# EAGLE design StrikeDetector (EAGLE 9.6.2)
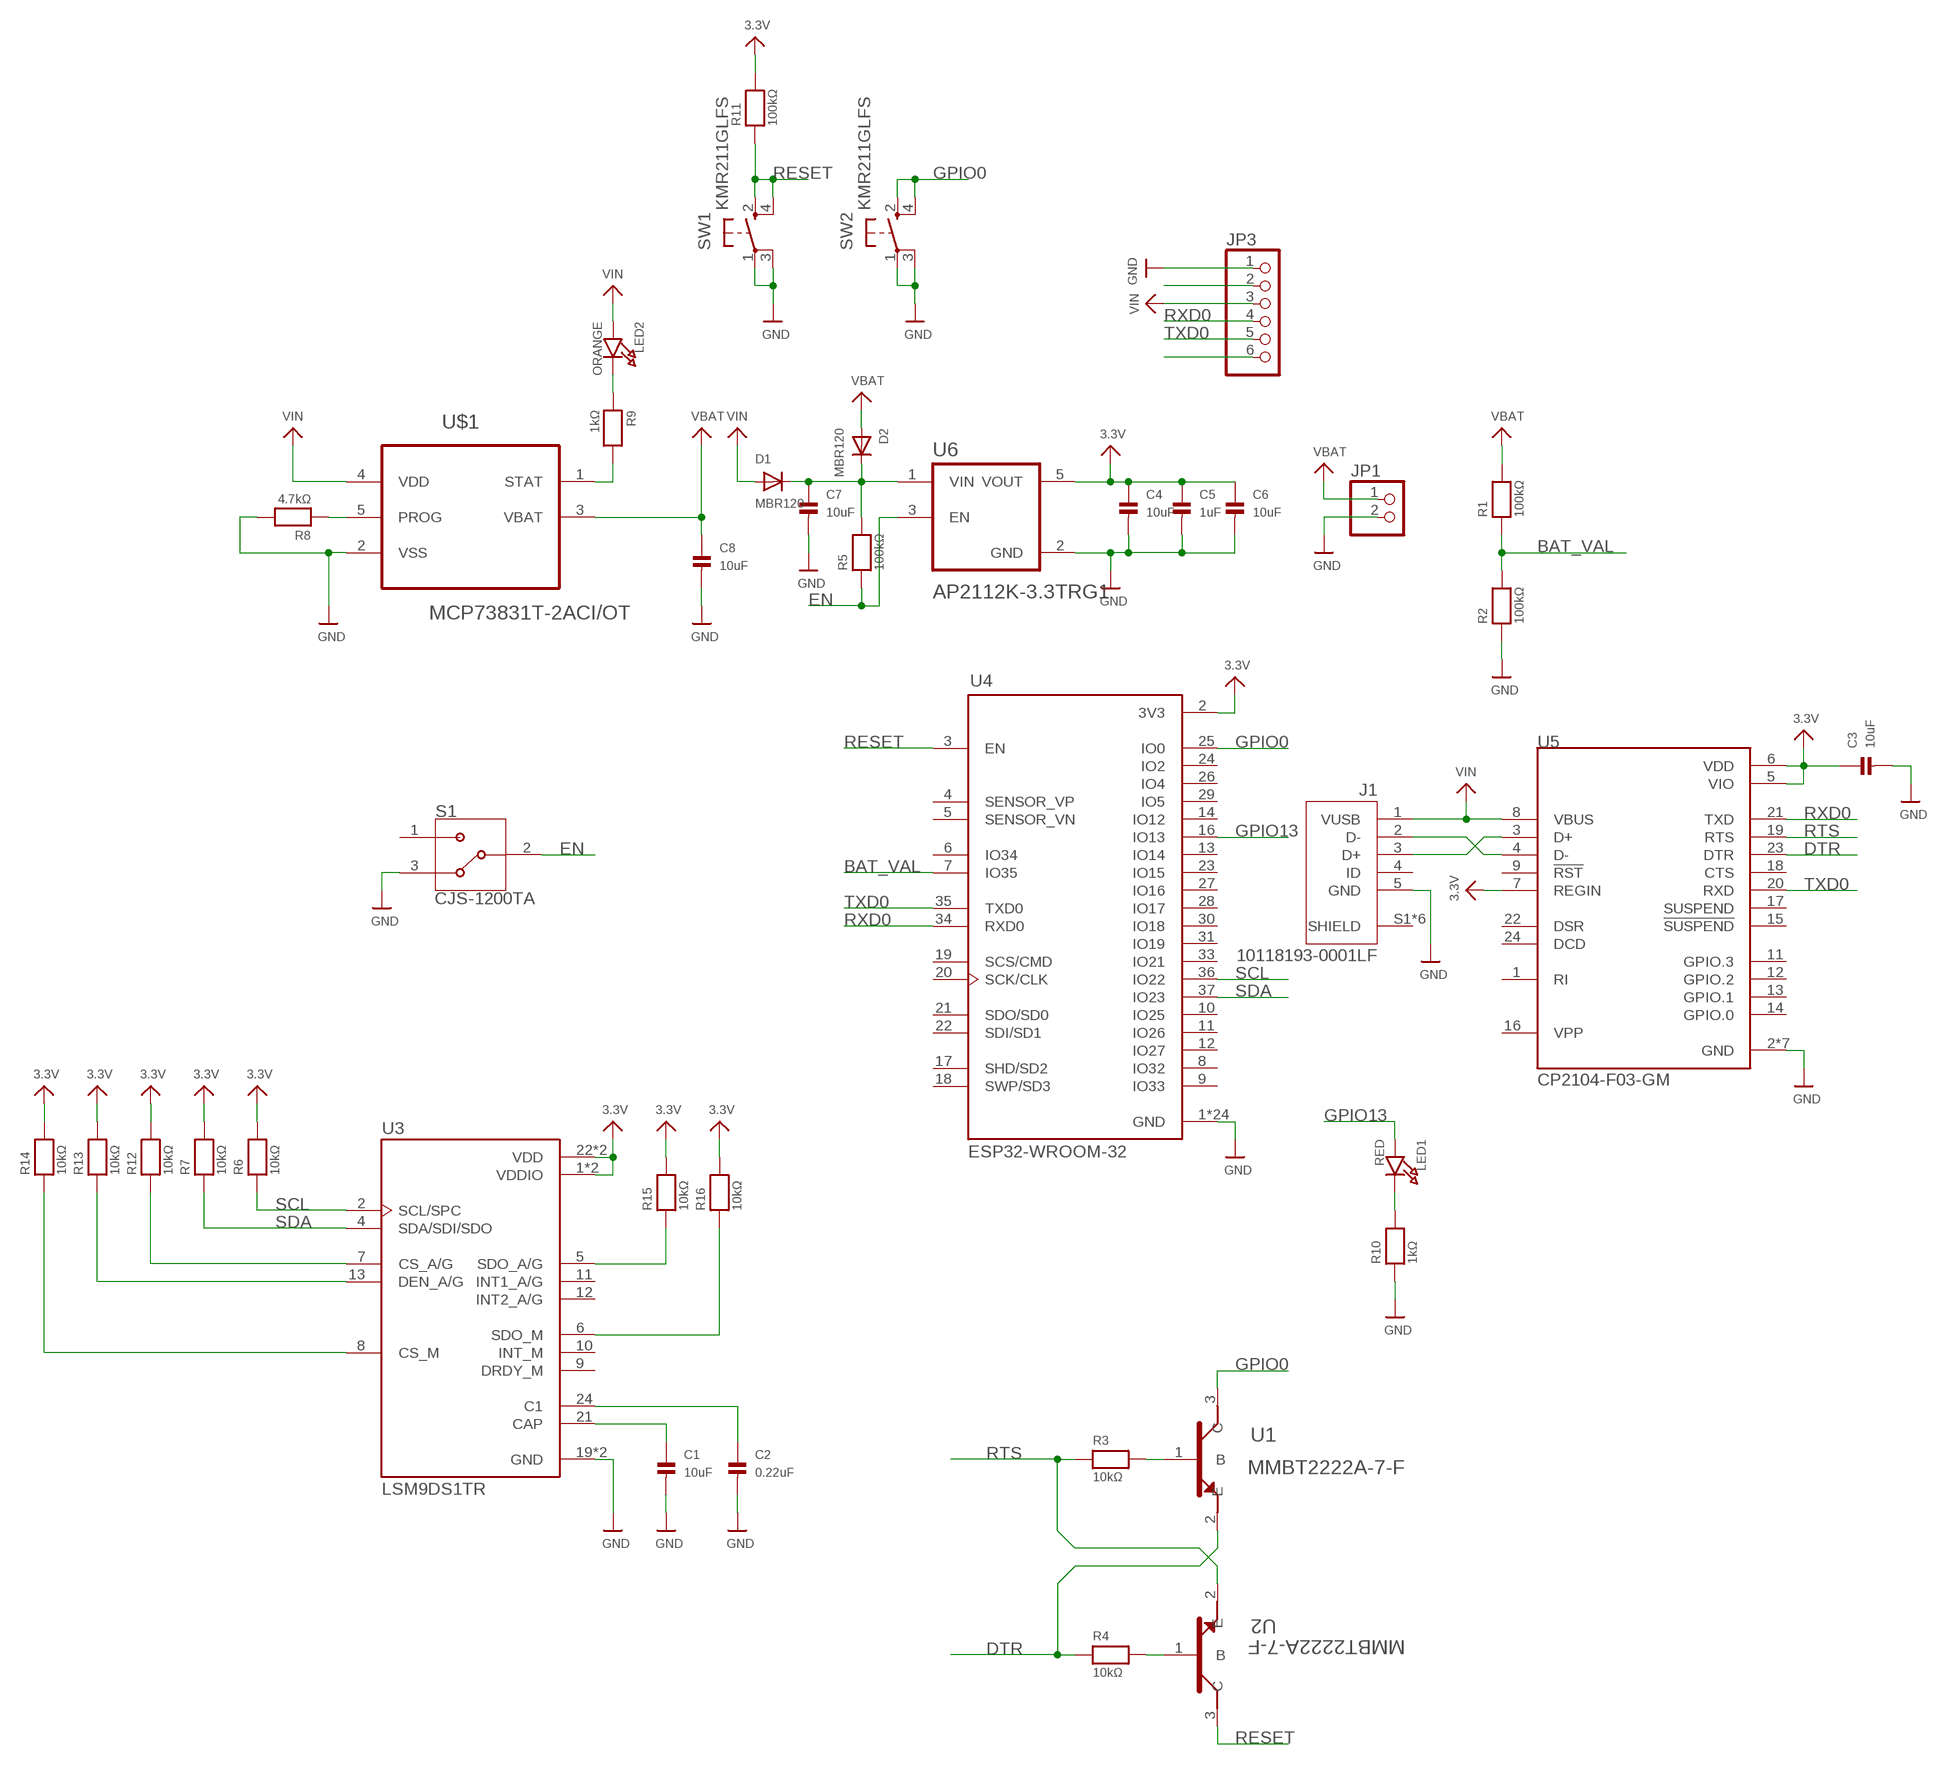
[diagram p0: schematic, sheet 1]

## Parts
C1  10uF  CAP_CERAMIC0603  [0603]
C2  0.22uF  CAP_CERAMIC0603  [0603]
C3  10uF  CAP_CERAMIC0603  [0603]
C4  10uF  CAP_CERAMIC0603  [0603]
C5  1uF  CAP_CERAMIC0603  [0603]
C6  10uF  CAP_CERAMIC0603  [0603]
C7  10uF  CAP_CERAMIC0603  [0603]
C8  10uF  CAP_CERAMIC0603  [0603]
D1  MBR120  DIODESOD-123  [SOD-123]
D2  MBR120  DIODESOD-123  [SOD-123]
J1  10118193-0001LF  [FCI_10118193-0001LF]
JP1  HEADER-1X2ROUND  [1X02_ROUND]
JP3  HEADER-1X6ROUND  [1X06_ROUND]
LED1  RED  LED0603  [CHIPLED_0603]
LED2  ORANGE  LED0603  [CHIPLED_0603]
R1  100kΩ  RESISTOR0603  [0603]
R2  100kΩ  RESISTOR0603  [0603]
R3  10kΩ  RESISTOR0603  [0603]
R4  10kΩ  RESISTOR0603  [0603]
R5  100kΩ  RESISTOR0603  [0603]
R6  10kΩ  RESISTOR0603  [0603]
R7  10kΩ  RESISTOR0603  [0603]
R8  4.7kΩ  RESISTOR0603  [0603]
R9  1kΩ  RESISTOR0603  [0603]
R10  1kΩ  RESISTOR0603  [0603]
R11  100kΩ  RESISTOR0603  [0603]
R12  10kΩ  RESISTOR0603  [0603]
R13  10kΩ  RESISTOR0603  [0603]
R14  10kΩ  RESISTOR0603  [0603]
R15  10kΩ  RESISTOR0603  [0603]
R16  10kΩ  RESISTOR0603  [0603]
S1  CJS-1200TA  [SW_CJS-1200TA]
SW1  KMR211GLFS  SPST_TACT-KMR2  [KMR2]
SW2  KMR211GLFS  SPST_TACT-KMR2  [KMR2]
U1  MMBT2222A-7-F  [SOT103P240X110-3N]
U2  MMBT2222A-7-F  [SOT103P240X110-3N]
U3  LSM9DS1TR  [PQFN43P300X350X102-24N]
U4  ESP32-WROOM-32  [MODULE_ESP32-WROOM-32]
U5  CP2104-F03-GM  [QFN50P400X400X80-25N]
U6  AP2112K-3.3TRG1  [SOT95P285X140-5N]
U$1  MCP73831T-2ACI/OT  [SOT95P280X145-5N]

## Nets
3.3V: C3.1 C4.1 C5.1 C6.1 R6.2 R7.2 R11.2 R12.2 R13.2 R14.2 R15.2 R16.2 U3.1(VDDIO) U3.3(VDDIO) U3.22(VDD) U3.23(VDD) U4.2(3V3) U5.5(VIO) U5.6(VDD) U5.7(REGIN) U6.5(VOUT)
BAT_VAL: R1.1 R2.2 U4.7(IO35)
DTR: R4.1 U1.2(E) U5.23(DTR)
EN: R5.1 S1.2 U6.3(EN)
GND: C1.2 C2.2 C3.2 C4.2 C5.2 C6.2 C7.2 C8.2 J1.5(GND) JP1.2 JP3.1 R2.1 R8.2 R10.1 S1.3 SW1.1(P) SW1.3(P1) SW2.1(P) SW2.3(P1) U3.19(GND) U3.20(GND) U4.1(GND) U4.15(GND) U4.38(GND) U4.39_1(GND) U4.39_2(GND) U4.39_3(GND) U4.39_4(GND) U4.39_5(GND) U4.39_6(GND) U4.39_7(GND) U4.39_8(GND) U4.39_9(GND) U4.39_10(GND) U4.39_11(GND) U4.39_12(GND) U4.39_13(GND) U4.39_14(GND) U4.39_15(GND) U4.39_16(GND) U4.39_17(GND) U4.39_18(GND) U4.39_19(GND) U4.39_20(GND) U4.39_21(GND) U5.2(GND) U5.25(GND) U5.THERM_1(GND) U5.THERM_2(GND) U5.THERM_3(GND) U5.THERM_4(GND) U5.THERM_5(GND) U6.2(GND) U$1.2(VSS)
GPIO0: SW2.2(S) SW2.4(S1) U1.3(C) U4.25(IO0)
GPIO13: LED1.A U4.16(IO13)
N$1: C1.1 U3.21(CAP)
N$2: J1.3(D+) U5.3(D+)
N$3: J1.2(D-) U5.4(D-)
N$4: C2.1 U3.24(C1)
N$5: R3.2 U1.1(B)
N$6: R4.2 U2.1(B)
N$7: C7.1 D1.C D2.C R5.2 U6.1(VIN)
N$8: R8.1 U$1.5(PROG)
N$9: R9.2 U$1.1(STAT)
N$10: LED2.C R9.1
N$11: LED1.C R10.2
N$12: R12.1 U3.7(CS_A/G)
N$13: JP3.2
N$14: R13.1 U3.13(DEN_A/G)
N$15: R14.1 U3.8(CS_M)
N$16: R15.1 U3.5(SDO_A/G)
N$17: JP3.6
N$18: R16.1 U3.6(SDO_M)
RESET: R11.1 SW1.2(S) SW1.4(S1) U2.3(C) U4.3(EN)
RTS: R3.1 U2.2(E) U5.19(RTS)
RXD0: JP3.4 U4.34(RXD0) U5.21(TXD)
SCL: R6.1 U3.2(SCL/SPC) U4.36(IO22)
SDA: R7.1 U3.4(SDA/SDI/SDO) U4.37(IO23)
TXD0: JP3.5 U4.35(TXD0) U5.20(RXD)
VBAT: C8.1 D2.A JP1.1 R1.2 U$1.3(VBAT)
VIN: D1.A J1.1(VUSB) JP3.3 LED2.A U5.8(VBUS) U$1.4(VDD)
Unconnected: J1.4(ID) J1.S1(SHIELD) J1.S2(SHIELD) J1.S3(SHIELD) J1.S4(SHIELD) J1.S5(SHIELD) J1.S6(SHIELD) S1.1 U3.9(DRDY_M) U3.10(INT_M) U3.11(INT1_A/G) U3.12(INT2_A/G) U4.4(SENSOR_VP) U4.5(SENSOR_VN) U4.6(IO34) U4.8(IO32) U4.9(IO33) U4.10(IO25) U4.11(IO26) U4.12(IO27) U4.13(IO14) U4.14(IO12) U4.17(SHD/SD2) U4.18(SWP/SD3) U4.19(SCS/CMD) U4.20(SCK/CLK) U4.21(SDO/SD0) U4.22(SDI/SD1) U4.23(IO15) U4.24(IO2) U4.26(IO4) U4.27(IO16) U4.28(IO17) U4.29(IO5) U4.30(IO18) U4.31(IO19) U4.33(IO21) U5.1(RI) U5.9(!RST) U5.11(GPIO.3) U5.12(GPIO.2) U5.13(GPIO.1) U5.14(GPIO.0) U5.15(!SUSPEND) U5.16(VPP) U5.17(SUSPEND) U5.18(CTS) U5.22(DSR) U5.24(DCD)

## Library data of the parts
C1-C8 = microbuilder:CAP_CERAMIC: Ceramic Capacitors 0402 - 0402 Surface Mount Capacitors 16pF 50V 5% [Digikey: 445-4899-2-ND] 18pF 50V 5% [Digikey: 490-1281-2-ND] 22pF 50V 5% [Digikey: 490-1283-2-ND] 68pF 50V 5% [Digikey: 490-1289-2-ND] 0.1uF 10V 10% [Digikey: 490-1318-2-ND] 1.0uF 6.3V 10% [Digikey: 490-1320-2-ND] 0603 - 0603 Surface Mount Capacitors 16 pF 50V 5% [Digikey: 445-5051-2-ND] 22 pF 50V [Digikey: PCC220ACVTR-ND] 33 pF 50V 5% [Digikey: 490-1415-1-ND] 56pF 50V 5% [Digikey: 490-1421-1-ND] 220pF 50V 5% [Digikey: 445-1285-1-ND] 680 pF 50V 2200 pF 50V 5% C0G [Digikey: 445-1297-1-ND] 5600 pF 100V 5% X7R [Digikey: 478-3711-1-ND] 0.1 µF 25V 10% [Digikey: PCC2277TR-ND] 0.22 µF 16V 10% X7R [Digikey: 445-1318-1-ND] 1.0 µF 25V 10% [Digikey: 445-5146-2-ND] 0603 - RF Specific 3pF 250V +/-0.1pF RF [Digikey: 712-1347-1-ND] 18 pF 250V 5% [Digikey: 478-3505-1-ND or 712-1322-1-ND] 56 pF 250V 5% C0G RF [Digikey: 490-4867-1-ND] 68 pF 250V RF [Digikey: 490-4868-1-ND] 0805 - 0805 Surface Mount Capacitors 220 pF 250V 2% RF Ceramic Capacitor [Digikey: 712-1398-1-ND] 1000 pF 50V 2% NP0 Ceramic Capacitor [Digikey: 478-3760-1-ND] 0.1 µF 25V 10% Ceramic Capacitor [Digikey: PCC1828TR-ND] 1.0 µF 16V 10% Ceramic Capacitor[Digikey: 490-1691-2-ND] 10.0 µF 10V 10% Ceramic Capacitor[Digikey: 709-1228-1-ND] 10.0 uF 16V 10% Ceramic Capacitor [Digikey: 478-5165-2-ND] 47 uF 6.3V 20% Ceramic Capacitor [Digikey: 587-1779-1-ND or 399-5506-1-ND] 1206 - 1206 Surface Mount Capacitors 47uF 10V 20% Ceramic Capacitor [Digikey: 490-5528-1-ND or 399-5508-1-ND or 445-6010-1-ND] 100uF 6.3V -20%, +80% Y5V Ceramic Capacitor (Digikey: 490-4512-1-ND, Mouser: 81-GRM31CF50J107ZE1L)
D1 D2 = microbuilder:DIODE: Diode SMA Model Volts Amps Type Vf Vr Digikey # Notes SSA34-E3 40V 3A Schottky 480mV @ 3A 200uA @ 40V SSA34-E3/61TGITR-ND CDBA120-G 20V 1A Schottky 500mV @ 1A 500uA @ 20V 641-1014-6-ND REEL MBRA210 10V 2A Schottky 350mV @ 2A 700uA @ 10V MBRA210LT3 SOD-123 Model Volts Amps Type Vf Vr Order # Notes BAT54T1G 30V 200mA Schottky 800mV @ 200mA 2uA @ 25V BAT54T1GOSTR-ND B0530W 30V 500mA Schottky 430mV @ 500mA 130uA @ 30V B0530W-FDICT-ND REEL MBR120 1A 20V Schottky 340mV @ 1A MBR120VLSFT1GOSCT-ND SOD-323 Model Volts Amps Type Vf Vr Order # Notes PMEG2005EJ 20V 500mA Schottky 355mV @ 500mA 568-4110-1-ND ZLLS410 10V 570mA Schottky 380mV @ 570mA ZLLS410CT-ND 1N4148WS 75V 150mA Silicon/Simple 1V 1N4148WSFSCT-ND REEL SOD-523 Model Volts Amps Type Vf Vr Order # Notes BAT54XV2 30V 200mA Schottky 0.8V @ 100mA BAT54XV2CT-ND TB751S 30V 30mA Schottky RB751S-40TE61CT-ND SOT23-R/W (R = Solder Paste/Reflow Ovens, W = Hand-Soldering) Model Volts Amps Type Vf Vr Order # Notes BAT54FILM 40V 300mA Schottky 497-7162-1-ND
J1 = 10118193-0001LF:10118193-0001LF: Micro USB B Type Receptacle; DESCRIPTION: USB - micro B USB 2.0 Receptacle Connector 5 Position Surface Mount, Right Angle; Through Hole; DIGI-KEY_PART_NUMBER: 609-4616-1-ND; DIGIKEY-PURCHASE-URL: https://snapeda.com/shop?store=DigiKey&id=4800618; MF: Amphenol ICC (FCI); MOUSER-PURCHASE-URL: https://snapeda.com/shop?store=Mouser&id=4800618; MP: 10118193-0001LF; PACKAGE: None
JP1 = microbuilder:HEADER-1X2: PIN HEADER
JP3 = microbuilder:HEADER-1X6: PIN HEADER
LED1 LED2 = microbuilder:LED: LED 0603 - 0603 Surface Mount Package 2mA: Green LED - Low Power (3.9mcd, 2ma, 1.7Vf) - Digikey: 475-2709-2-ND Orange LED - Low Power (9.8mcd, 2ma, 1.8Vf) - Digikey: 475-1194-2-ND Red LED - Low Power (5mcd, 2ma, 1.8Vf) - Digikey: 475-1195-2-ND Yellow LED - Low Power (7mcd, 2ma, 1.8Vf) - Digikey: 475-1196-2-ND 5mA: Blue LED - Low Power (17mcd, 5ma, 2.9Vf) - Digikey: LNJ937W8CRACT-ND 0805 - 0805 Surface Mount Package 2mA: Red LED (8.8mcd, 2mA, 1.8Vf, Clear) - Low Power [Digikey: 475-2510-1-ND] Green LED (5mcd, 2mA, 1.8Vf, Clear) - Low Power [Digikey: 475-2730-1-ND] Yellow LED (11.3mcd, 2mA, 1.8Vf, Clear) - Low Power [Digikey: 475-2555-1-ND] 20mA: Red LED (104mcd, 20mA, Diffused) - LS R976 [Digikey: 475-1278-6-ND] Red LED (12mcd, 20mA, 2.0Vf, Clear) - APT2012EC [Digikey: 754-1128-1-ND] Green LED (15mcd, 20mA, 2.2Vf, Clear) - APT2012GC [Digikey: 754-1131-1-ND] Orange LED (160mcd, 20mA, 2.1Vf, Clear) - APT2012SECK [Digikey: 754-1130-1-ND] 1206 - 1206 Surface Mount Package Green LED (26mcd, 20mA, Diffused) - LG N971 [Digikey: 475-1407-6-ND] Red LED (15mcd, 20mA, Diffused) - LH N974 [Digikey: 475-1416-6-ND]
R1-R16 = microbuilder:RESISTOR: Resistors 0402 - 0402 Surface Mount Package 22 Ohm 1% 1/16W [Digikey: 311-22.0LRTR-ND] 33 Ohm 5% 1/16W 1.0K 5% 1/16W 1.5K 5% 1/16W 2.0K 1% 1/16W 10.0K 1% 1/16W [Digikey: 311-10.0KLRTR-ND] 10.0K 5% 1/16W [Digikey: RMCF0402JT10K0TR-ND] 12.1K 1% 1/16W [Digikey: 311-22.0LRTR-ND] 100.0K 5% 1/16W 0603 - 0603 Surface Mount Package 0 Ohm 1/10 Watt 1% Resistor 15 Ohm 1/10 Watt 1% Resistor 33 Ohm 1/10 Watt 1% Resistor 49.9 Ohm 1/10 Watt 1% Resistor 100 Ohm 1/10 Watt 1% Resistor 150 Ohm 1/10 Watt 1% Resistor 240 Ohm 1/10 Watt 1% Resistor 390 Ohm 1/10 Watt 1% Resistor 560 Ohm 1/10 Watt 1% Resistor 680 Ohm 1/10 Watt 1% Resistor 750 Ohm 1/10 Watt 1% Resistor 1.0K Ohm 1/10 Watt 1% Resistor 1.5K Ohm 1/10 Watt 1% Resistor 2.0K Ohm 1/10 Watt 1% Resistor 2.2K Ohm 1/10 Watt 1% Resistor 3.3K Ohm 1/10 Watt 1% Resistor 4.7K Ohm 1/10 Watt 1% Resistor 10.0K Ohm 1/10 Watt 1% Resistor 12.0K Ohm 1/10 Watt 1% Resistor 12.1K Ohm 1/10 Watt 1% Resistor 20.0K Ohm 1/10 Watt 1% Resistor 33.0K Ohm 1/10 Watt 1% Resistor 100.0K Ohm 1/10 Watt 1% Resistor 0805 - 0805 Surface Mount Package 0 Ohm 1/8 Watt 1% Resistor 33 Ohm 1/8 Watt 1% Resistor 100 Ohm 1/8 Watt 1% Resistor 150 Ohm 1/8 Watt 1% Resistor 200 Ohm 1/8 Watt 1% Resistor 240 Ohm 1/8 Watt 1% Resistor 330 Ohm 1/8 Watt 1% Resistor 390 Ohm 1/8 Watt 1% Resistor 470 Ohm 1/8 Watt 1% Resistor 1.0K Ohm 1/8 Watt 1% Resistor 1.5K Ohm 1/8 Watt 1% Resistor 2.0K Ohm 1/8 Watt 1% Resistor 4.7K Ohm 1/8 Watt 1% Resistor 5.1K Ohm 1/8 Watt 1% Resistor 5.6K Ohm 1/8 Watt 1% Resistor 10.0K Ohm 1/8 Watt 1% Resistor 22.0K Ohm 1/8 Watt 1% Resistor 33.0K Ohm 1/8 Watt 1% Resistor 100K Ohm 1/8 Watt 1% Resistor 1206 - 1206 Surface Mount Package 2012 - 2010 Surface Mount Package 0.11 Ohm 1/2 Watt 1% Resistor - Digikey: RHM.11UCT-ND
S1 = CJS-1200TA:CJS-1200TA: Switch Slide N.O./N.C. SPDT Raised Slide 0.1A 24VDC J-Hook SMD Embossed T/R; DESCRIPTION: Slide Switch SPDT Surface Mount; DIGI-KEY_PART_NUMBER: 563-1021-1-ND; DIGIKEY-PURCHASE-URL: https://snapeda.com/shop?store=DigiKey&id=2766327; MF: Nidec Copal; MOUSER-PURCHASE-URL: https://snapeda.com/shop?store=Mouser&id=2766327; MP: CJS-1200TA; PACKAGE: None
SW1 SW2 = adafruit:SPST_TACT: SMT 6mm switch, EVQQ2 series http://www.ladyada.net/library/eagle
U1 U2 = MMBT2222A-7-F:MMBT2222A-7-F: NPN SMALL SIGNAL SURFACE MOUNT TRANSISTOR; DESCRIPTION: Bipolar (BJT) Transistor NPN 40V 600mA 300MHz 310mW Surface Mount SOT-23-3; DIGI-KEY_PART_NUMBER: MMBT2222A-FDICT-ND; DIGIKEY-PURCHASE-URL: https://snapeda.com/shop?store=DigiKey&id=229424; MF: Diodes Inc.; MOUSER-PURCHASE-URL: https://snapeda.com/shop?store=Mouser&id=229424; MP: MMBT2222A-7-F; PACKAGE: SOT-23-3 Diodes Inc.
U3 = LSM9DS1TR:LSM9DS1TR: The LSM9DS1 is a system-in-package featuring a 3D digital linear acceleration sensor, a 3D digital angular rate sensor, and a 3D digital magnetic sensor.; DESCRIPTION: Accelerometer, Gyroscope, Magnetometer, Temperature, 9 Axis Sensor I²C, SPI Output; DIGI-KEY_PART_NUMBER: 497-14946-1-ND; DIGIKEY-PURCHASE-URL: https://snapeda.com/shop?store=DigiKey&id=106273; MF: STMicroelectronics; MOUSER-PURCHASE-URL: https://snapeda.com/shop?store=Mouser&id=106273; MP: LSM9DS1TR; PACKAGE: TFLGA-24 STMicroelectronics
U4 = ESP32-WROOM-32:ESP32-WROOM-32: Bluetooth, WiFi Transceiver Module 2.4GHz ~ 2.5GHz Surface Mount; DESCRIPTION: Bluetooth, WiFi Transceiver Module 2.4GHz ~ 2.5GHz Surface Mount; DIGI-KEY_PART_NUMBER: 1904-1010-1-ND; MF: Espressif Systems; MP: ESP32-WROOM-32; PACKAGE: Module Espressif Systems
U5 = CP2104-F03-GM:CP2104-F03-GM: USB-to-UART 1-CH 576byte FIFO 3.3V 24-Pin QFN EP T/R; DESCRIPTION: USB Bridge, USB to UART USB 2.0 UART Interface 24-QFN (4x4); DIGI-KEY_PART_NUMBER: 336-4146-2-ND; MF: Silicon Labs; MP: CP2104-F03-GM; PACKAGE: QFN-24 Silicon Labs
U6 = AP2112K-3.3TRG1:AP2112K-3.3TRG1: AP2112 Series 0.6 A 3.3 V Fixed Output SMT LDO Linear Regulator - SOT23-5; DESCRIPTION: Linear Voltage Regulator IC 1 Output 600mA SOT-25; DIGI-KEY_PART_NUMBER: AP2112K-3.3TRG1DICT-ND; DIGIKEY-PURCHASE-URL: https://snapeda.com/shop?store=DigiKey&id=454988; MF: Diodes Inc.; MOUSER-PURCHASE-URL: https://snapeda.com/shop?store=Mouser&id=454988; MP: AP2112K-3.3TRG1; PACKAGE: SOT-753 Diodes Inc.
U$1 = MCP73831T-2ACI_OT:MCP73831T-2ACI/OT: Charge Management Controller; DESCRIPTION: Charger IC Lithium Ion/Polymer SOT-23-5; DIGI-KEY_PART_NUMBER: MCP73831T-2ACI/OTCT-ND; DIGIKEY-PURCHASE-URL: https://snapeda.com/shop?store=DigiKey&id=53208; MF: Microchip; MOUSER-PURCHASE-URL: https://snapeda.com/shop?store=Mouser&id=53208; MP: MCP73831T-2ACI/OT; PACKAGE: SOT-23 Microchip

## Board
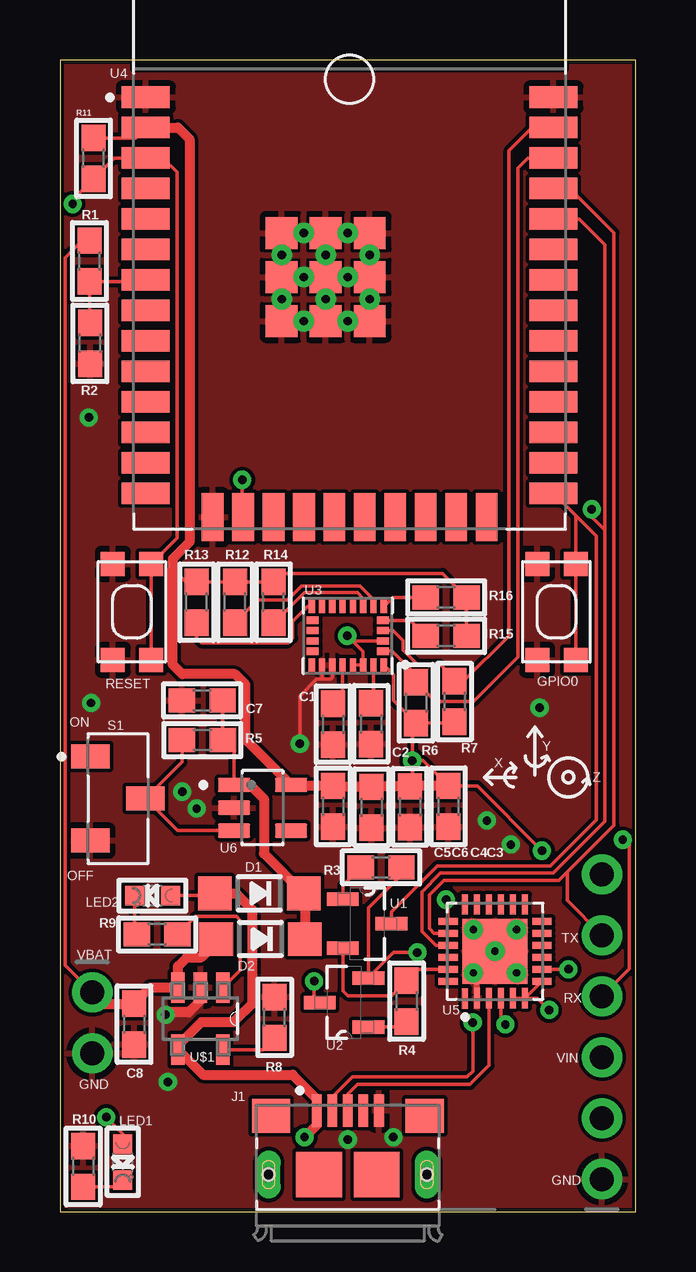
[diagram p1: board, top side]
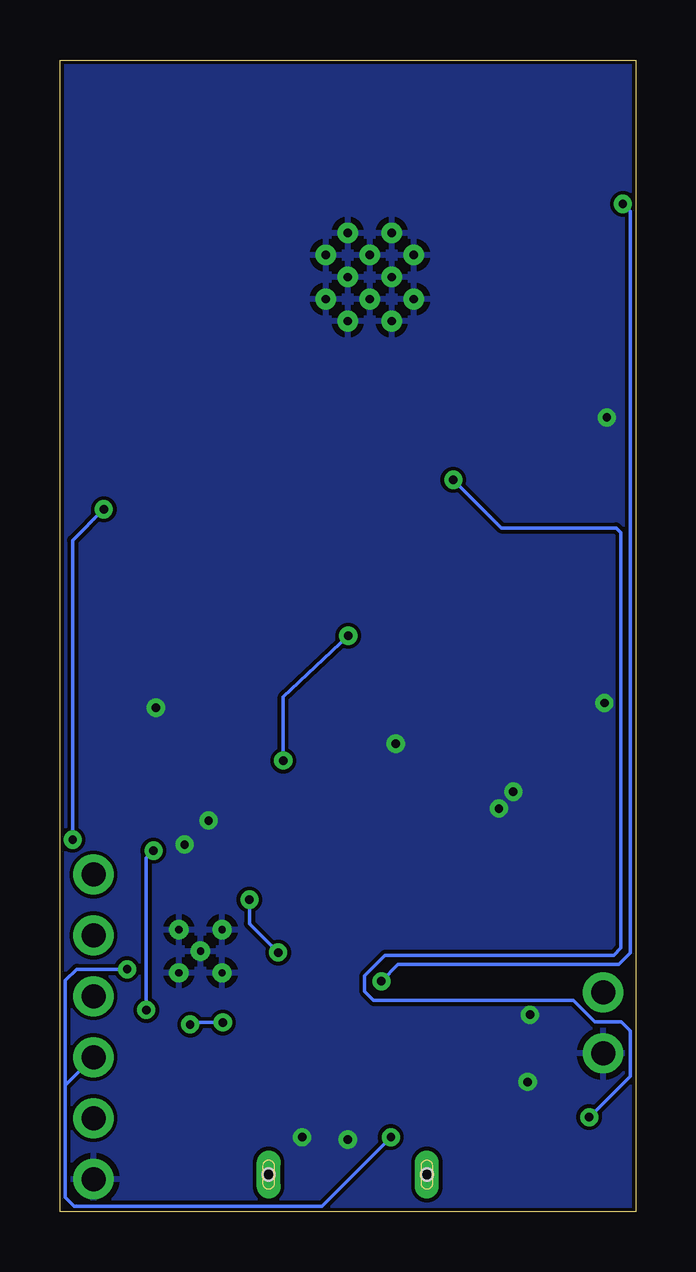
[diagram p2: board, bottom side, seen from below]

Size 24 x 48 mm. Coordinates in mm from the lower left corner, seen from the top.
Outline: 0,0 24,0 24,48 0,48 0,0
Copper layers (1*16): Top 0.035mm / dielectric 1.5mm / Bottom 0.035mm
Design rules "default *": minimum track width 6mil, minimum drill 0.35mm, track to track 5mil, track to pad 5mil, pad to pad 5mil, via to via 5mil, smd to smd 5mil, copper to edge 5mil, drill to drill 5mil, minimum pad ring 10mil, minimum via ring 8mil, stop-mask expansion 4mil, vias tented up to drill 0mil, thermal gap 10mil

### Footprints (pad centres in the part's own frame; a part is rotated, then mirrored left to right if it is on the bottom)
0603 = smd 1.1 x 1: 1 -0.85,0; 2 0.85,0
SOD-123 = smd 1.4 x 1.4: A 1.85,0; C -1.85,0
FCI_10118193-0001LF = smd 0.4 x 1.35: 1 -1.3,2.675; 2 -0.65,2.675; 3 0,2.675; 4 0.65,2.675; 5 1.3,2.675 | smd 1.6 x 1.4: S1 -3.2,2.45; S2 3.2,2.45 | smd 1.9 x 1.9: S3 1.2,0; S4 -1.2,0 | drill 0.5 pad 0.9 long: S5 -3.3,0; S6 3.3,0 | hole 0.5: -3.3,0; 3.3,0
1X02_ROUND = drill 1 pad 1.676: 1 -1.27,0; 2 1.27,0
1X06_ROUND = drill 1 pad 1.676: 1 -6.35,0; 2 -3.81,0; 3 -1.27,0; 4 1.27,0; 5 3.81,0; 6 6.35,0
CHIPLED_0603 = smd 0.8 x 0.8: A 0,-0.75; C 0,0.75
SW_CJS-1200TA = smd 1 x 1.6: 1 -1.75,-1.15; 2 0,1.15; 3 1.75,-1.15
KMR2 = smd 1 x 1: 1 2,0.8; 2 2,-0.8; 3 -2,0.8; 4 -2,-0.8
SOT103P240X110-3N = smd 1.321 x 0.559: 1 -1.016,1.016; 2 -1.016,-1.016; 3 1.016,0
PQFN43P300X350X102-24N = smd 0.28 x 0.53: 1 -1.505,1.22; 6 -1.505,-1.22; 7 -1.075,-1.22; 8 -0.645,-1.22; 9 -0.215,-1.22; 10 0.215,-1.22; 11 0.645,-1.22; 12 1.075,-1.22; 13 1.505,-1.22; 18 1.505,1.22; 19 1.075,1.22; 20 0.645,1.22; 21 0.215,1.22; 22 -0.215,1.22; 23 -0.645,1.22; 24 -1.075,1.22 | smd 0.53 x 0.28: 2 -1.47,0.645; 3 -1.47,0.215; 4 -1.47,-0.215; 5 -1.47,-0.645; 14 1.47,-0.645; 15 1.47,-0.215; 16 1.47,0.215; 17 1.47,0.645
MODULE_ESP32-WROOM-32 = smd 2 x 0.9: 1 -8.5,5.26; 2 -8.5,3.99; 3 -8.5,2.72; 4 -8.5,1.45; 5 -8.5,0.18; 6 -8.5,-1.09; 7 -8.5,-2.36; 8 -8.5,-3.63; 9 -8.5,-4.9; 10 -8.5,-6.17; 11 -8.5,-7.44; 12 -8.5,-8.71; 13 -8.5,-9.98; 14 -8.5,-11.25; 25 8.5,-11.25; 26 8.5,-9.98; 27 8.5,-8.71; 28 8.5,-7.44; 29 8.5,-6.17; 30 8.5,-4.9; 31 8.5,-3.63; 32 8.5,-2.36; 33 8.5,-1.09; 34 8.5,0.18; 35 8.5,1.45; 36 8.5,2.72; 37 8.5,3.99; 38 8.5,5.26 | smd 0.9 x 2: 15 -5.715,-12.25; 16 -4.445,-12.25; 17 -3.175,-12.25; 18 -1.905,-12.25; 19 -0.635,-12.25; 20 0.635,-12.25; 21 1.905,-12.25; 22 3.175,-12.25; 23 4.445,-12.25; 24 5.715,-12.25 | smd 1.33 x 1.33: 39_1 -2.835,-0.405; 39_2 -1,-0.405; 39_3 0.835,-0.405; 39_4 -2.835,-2.24; 39_5 -1,-2.24; 39_6 0.835,-2.24; 39_7 -2.835,-4.075; 39_8 -1,-4.075; 39_9 0.835,-4.075 | drill 0.35: 39_10 -1.917,-0.405; 39_11 -0.083,-0.405; 39_12 -2.835,-1.323; 39_13 -1,-1.323; 39_14 0.835,-1.323; 39_15 -1.917,-2.24; 39_16 -0.083,-2.24; 39_17 -2.835,-3.158; 39_18 -1,-3.158; 39_19 0.835,-3.158; 39_20 -1.917,-4.075; 39_21 -0.083,-4.075
QFN50P400X400X80-25N = smd 0.84 x 0.26: 1 -1.97,1.25 | smd 0.82 x 0.26: 2 -1.955,0.75; 3 -1.955,0.25; 4 -1.955,-0.25; 5 -1.955,-0.75; 6 -1.955,-1.25; 13 1.955,-1.25; 14 1.955,-0.75; 15 1.955,-0.25; 16 1.955,0.25; 17 1.955,0.75; 18 1.955,1.25 | smd 0.26 x 0.82: 7 -1.25,-1.955; 8 -0.75,-1.955; 9 -0.25,-1.955; 10 0.25,-1.955; 11 0.75,-1.955; 12 1.25,-1.955; 19 1.25,1.955; 20 0.75,1.955; 21 0.25,1.955; 22 -0.25,1.955; 23 -0.75,1.955; 24 -1.25,1.955 | smd 2.7 x 2.7: 25 0,0 | drill 0.3: THERM_1 0,0; THERM_2 -0.9,0.9; THERM_3 0.9,0.9; THERM_4 0.9,-0.9; THERM_5 -0.9,-0.9
SOT95P285X140-5N = smd 1.35 x 0.6: 1 -1.185,0.95; 2 -1.185,0; 3 -1.185,-0.95; 4 1.185,-0.95; 5 1.185,0.95
SOT95P280X145-5N = smd 1.27 x 0.559: 1 -1.295,0.94; 2 -1.295,0; 3 -1.295,-0.94; 4 1.295,-0.94; 5 1.295,0.94

### Placement (x,y rotation side)
C1  11.39,20.31 270 top
C2  12.97,20.33 270 top
C3  16.19,16.89 270 top
C4  14.59,16.87 270 top
C5  11.39,16.89 270 top
C6  12.99,16.85 270 top
C7  5.93,21.31 180 top
C8  3.09,7.81 270 top
D1  8.31,13.26 180 top
D2  8.36,11.36 180 top
J1  12,1.54 0 top
JP1  1.35,7.86 270 top
JP3  22.6,7.7 90 top
LED1  2.62,2.06 180 top
LED2  3.86,13.17 90 top
R1  1.23,39.62 90 top
R2  1.25,36.19 90 top
R3  13.39,14.35 180 top
R4  14.45,8.77 270 top
R5  5.94,19.65 0 top
R6  14.85,21.21 270 top
R7  16.45,21.26 270 top
R8  8.95,8.09 90 top
R9  4.05,11.55 0 top
R10  0.97,1.88 270 top
R11  1.4,43.9 90 top
R12  7.3,25.4 90 top
R13  5.7,25.4 90 top
R14  8.9,25.4 90 top
R15  16.1,24 0 top
R16  16.1,25.6 0 top
S1  2.42,17.21 270 top
SW1  3,25 90 top
SW2  20.7,25 90 top
U1  12.81,12 0 top
U2  11.85,8.71 180 top
U3  12,24 180 top
U4  12.08,41.19 0 top
U5  18.14,10.85 90 top
U6  8.45,16.83 0 top
U$1  5.86,8.04 270 top

### Tracks (layer width: path | path; a pad name or v marks a point on that pad's centre or on a via)
3.3V  (via drill 0.35)
  Top 0.152: U5.5 U5.6 | U5.6 U5.7 | U5.6 19.91,8.89 v20.4,8.4 | v20.1,15.04 17.4,17.74 C3.1 15.13,18.8 v14.69,18.8 | C4.1 14.69,17.82 v14.69,18.8 | R6.2 14.69,20.2 v14.69,18.8 | U3.3 12.31,23.79 v11.98,24 12.64,23.34 U3.23 U3.22 | U4.2 3.15,44.75 R11.2 | U3.1 13.9,22.39 13.9,21.31 R6.2 | R15.2 R16.2 15.95,26.6 9.25,26.6 R14.2 R12.2 R13.2 5.25,26.25 4.7,26.8 | R6.2 16.4,20.36 R7.2
  Top 0.406: C3.1 14.61,17.74 C4.1 13.01,17.72 C6.1 11.43,17.7 C5.1 9.68,17.74 U6.5 7.74,19.68 7.74,21.96 7.3,22.4 5.1,22.4 4.7,22.8 4.7,26.8 4.7,27.2 5.4,27.9 5.4,44.7 4.92,45.18 U4.2
  Bottom 0.152: v20.1,15.04 20.4,14.74 v20.4,8.4 | v14.69,18.8 14.69,21.45 v11.98,24
BAT_VAL
  Top 0.152: R2.2 1.23,37.04 R1.1 3.58,38.77 U4.7
DTR
  Top 0.152: U5.23 14.93,10.1 R4.1 13.83,9 12,9 11.79,9.21 U1.2
EN
  Top 0.152: U6.3 4.9,15.88 S1.2 5.09,18.73 R5.1
GND  (via drill 0.35)
  Top 0.152: U3.20 11.36,22.25 11.3,22.2 11,22.2 | 11,22.2 10.7,22.2 10,21.5 v10,19.5 | U3.19 10.93,22.27 11,22.2
  Top 0.254: U5.2 17.39,9.95 U5.THERM_2
  Top 0.406: U$1.2 5.86,8.79 5.37,8.3 4.5,8.3 v4.4,8.2
  other vias: 5.7,16.8 5.1,17.5 4.5,5.4 13.9,3.1 12,3 17.8,16.3 18.8,15.3 1.3,21.2 1.2,33.1 20,21
  pour Top (isolate 0.152, rank 6): -1.2,61.5 31.5,61.5 31.5,-3.1 -1.2,-3.1
  pour Bottom (isolate 0.152, rank 6): -1.1,61.5 31.6,61.5 31.6,-3.1 -1.1,-3.1
GPIO0
  Top 0.152: SW2.4 SW2.2 21.5,29.02 U4.25 22.36,28.16 22.36,16.32 20.45,14.41 15.75,14.41 13.83,12.49 U1.3
GPIO13  (via drill 0.35)
  Top 0.152: v1.93,3.93 2.62,3.24 LED1.A | U4.16 7.6,28.98 v7.6,30.5
  Bottom 0.152: v1.93,3.93 0.23,5.64 0.23,7.53 0.6,7.9 1.7,7.9 2.6,8.8 10.92,8.8 11.3,9.18 11.3,9.82 10.44,10.68 0.92,10.68 0.61,10.99 0.61,28.3 0.81,28.5 5.6,28.5 v7.6,30.5
N$1
  Top 0.152: C1.1 11.79,21.55 U3.21
N$2
  Top 0.152: U5.3 17.89,6.09 17.1,5.3 12.4,5.3 12,4.9 J1.3
N$3  (via drill 0.35)
  Top 0.152: v18.57,7.8 18.39,7.98 U5.4 | v17.21,7.88 17.21,5.84 16.97,5.61 12.19,5.61 11.35,4.76 J1.2
  Bottom 0.152: v18.57,7.8 18.49,7.88 v17.21,7.88
N$4
  Top 0.152: C2.1 13.07,21.29 U3.24
N$5
  Top 0.152: U1.1 11.79,13.6 R3.2
N$6
  Top 0.152: R4.2 14.22,7.69 U2.1
N$7
  Top 0.152: U6.1 7.26,19.18 R5.2 C7.1
  Top 0.406: U6.1 7.92,17.78 8.5,17.2 8.5,14.92 D1.C 10.21,13.21 D2.C
N$8
  Top 0.152: U$1.5 8.46,6.75 R8.1
N$9
  Top 0.152: R9.2 5.65,12.3 7.36,12.3 7.51,12.14 7.51,10.05 U$1.1
N$10
  Top 0.152: R9.1 3.11,11.64 LED2.C
N$11
  Top 0.152: R10.2 2.34,1.03 LED1.C
N$12
  Top 0.152: R12.1 8.25,25.5 9.49,25.5 10.07,26.08 12.52,26.08 13.07,25.52 U3.7
N$14
  Top 0.152: R13.1 5.7,23.9 5.9,23.7 9.5,23.7 9.7,23.9 9.7,24.6 10.32,25.22 U3.13
N$15
  Top 0.152: U3.8 12.64,25.55 12.4,25.8 10.19,25.8 8.94,24.55 R14.1
N$16
  Top 0.152: U3.5 14.61,24.64 R15.1
N$18
  Top 0.152: U3.6 13.88,25.6 R16.1
RESET  (via drill 0.35)
  Top 0.152: v10.6,9.6 10.6,8.94 U2.3 | SW1.4 SW1.2 4.88,28.08 4.88,43.32 4.29,43.91 U4.3 2.26,43.91 R11.1 0.53,42.18 v0.53,42
  Bottom 0.152: v10.6,9.6 9.9,10.3 0.7,10.3 0.23,10.77 0.23,41.7 v0.53,42
RTS  (via drill 0.35)
  Top 0.152: R3.1 14.24,14.04 12.87,12.67 U2.2 12.87,9.77 13.9,10.8 v14.9,10.8 | v16.1,13 16.18,12.91 U5.19
  Bottom 0.152: v16.1,13 16.1,12 v14.9,10.8
RXD0  (via drill 0.35)
  Top 0.152: 22.72,28.4 22.72,40.3 21.65,41.37 U4.34 | 22.72,28.4 22.17,28.95 v22.17,29.27 | v23.47,15.5 23.52,15.5 23.74,15.28 23.74,10.11 JP3.4 | 22.72,28.4 22.72,16.25 20.57,14.11 15.87,14.11 15.1,13.33 15.1,11.67 15.67,11.1 U5.21
  Bottom 0.152: v22.17,29.27 23.47,27.97 v23.47,15.5
SCL
  Top 0.152: U4.36 19.51,43.91 19.1,43.5 19.1,23.12 17.23,21.26 15.65,21.26 R6.1 14.9,22.11 14.9,22.3 13.85,23.36 U3.2
SDA
  Top 0.152: U4.37 19.68,45.18 18.72,44.22 18.72,24 16.83,22.11 R7.1 16.5,22.16 15.85,22.81 14.89,22.81 14.3,23.4 14.3,23.8 13.88,24.21 U3.4
TXD0
  Top 0.152: U5.20 15.6,11.6 15.4,11.8 15.4,13.2 16,13.8 20.8,13.8 21.15,14.15 | U4.35 21.26,42.64 23.1,40.8 23.1,16.1 21.15,14.15 | 21.15,14.15 21.15,12.96 JP3.5
VBAT
  Top 0.152: JP1.1 0.23,10.25 0.23,39.77 0.93,40.47 R1.2
  Top 0.406: JP1.1 1.82,8.66 C8.1 3.77,9.34 U$1.3 4.92,10.22 5.3,10.6 5.9,10.6 6.51,11.21 D2.A
VIN  (via drill 0.35)
  Top 0.152: LED2.A 6.37,13.17 D1.A | v21.2,10.1 U5.8
  Top 0.406: D1.A 7.34,13.26 8,12.6 8,8.65 7.25,7.9 5.9,7.9 4.92,6.92 U$1.4 5.96,5.7 9.7,5.7 10.7,4.7 J1.1 10.7,3.6 v10.2,3.1
  Bottom 0.152: v10.2,3.1 13.07,0.23 23.4,0.23 23.77,0.6 23.77,5.26 | 23.77,5.26 JP3.3 | 23.77,5.26 23.77,9.63 23.3,10.1 v21.2,10.1

### Text on the board
tPlace: RESET | GPIO0 | ON | Y | X | Z | OFF | TX | VBAT | RX | VIN | GND | GND